# EAGLE schematic 02A-007 Input Switch (EAGLE 6.3)
Assembly variants: HIGHSPEED

## Sheet 1 of 3
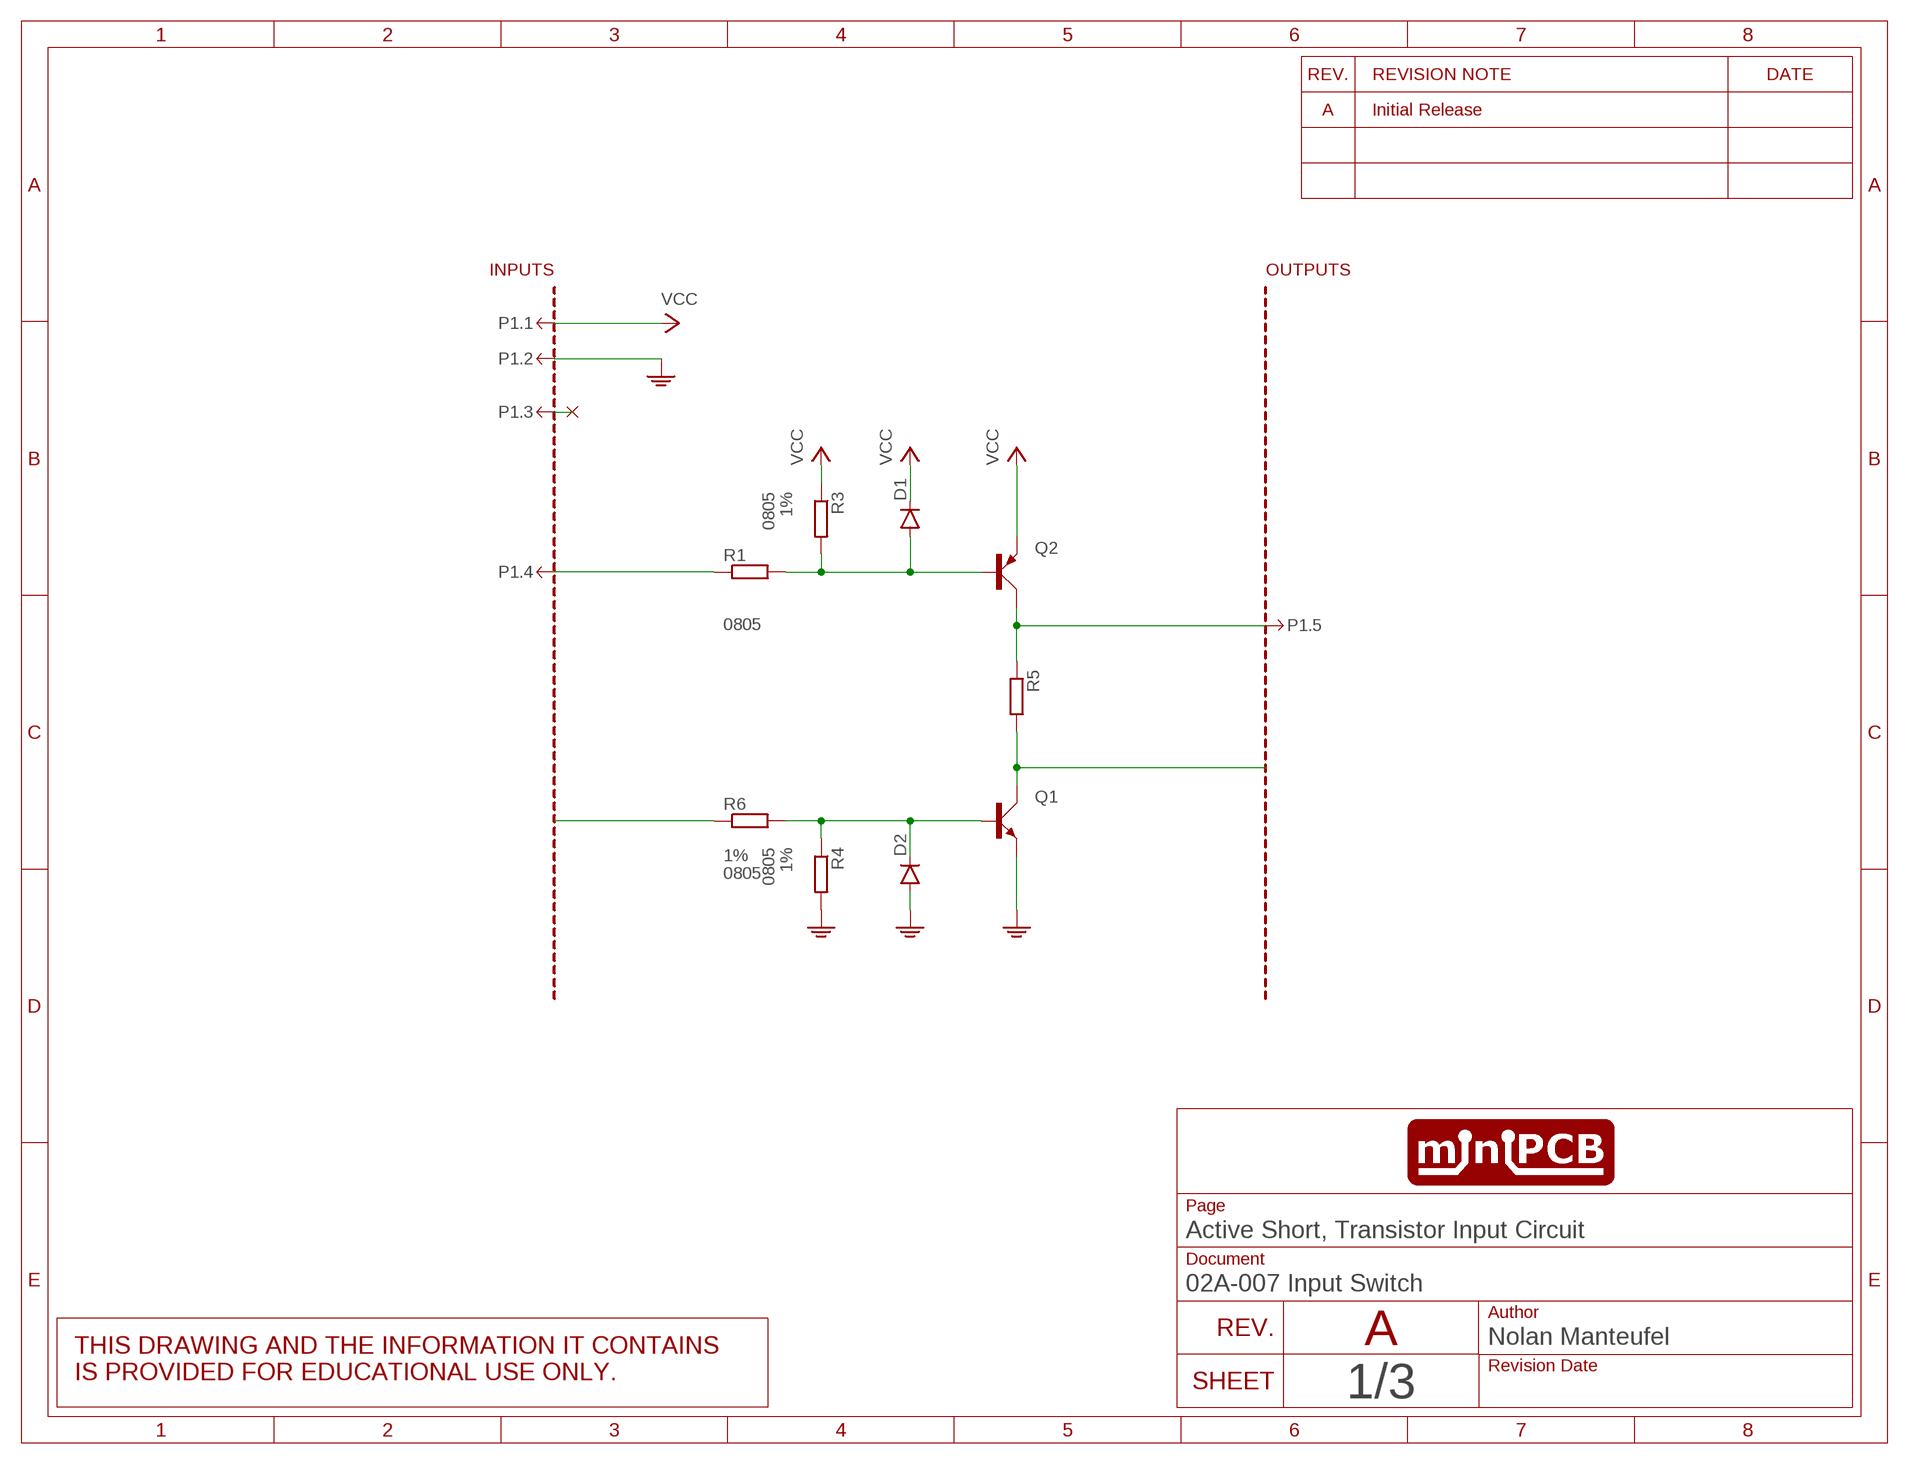
[diagram p0: schematic, sheet 1]

### Parts
D1  DIODE-SOD80C  [SOD80C]  (variant HIGHSPEED: 1N4148)
D2  DIODE-SOD80C  [SOD80C]  (not fitted in variant HIGHSPEED)
P1.  MINIPCB_4INCH  [PCB_5]
Q1  BJT_NPNBEC  [SOT23]
Q2  BJT_PNPBEC  [SOT23]
R1  R-EU_1%_R0805  [R0805]
R3  R-EU_1%_R0805  [R0805]
R4  R-EU_1%_R0805  [R0805]
R5  R-EU__R0805  [R0805]
R6  R-EU_1%_R0805  [R0805]

### Nets
GND: D2.A P1..1 Q1.2(E) R4.2
INPUT: P1..4 R1.1
N$1: D1.A Q2.1(B) R1.2 R3.2
N$2: P1..3
N$3: Q1.3(C) R5.2
N$4: D2.C Q1.1(B) R4.1 R6.2
N$5: P1..5 Q2.3(C) R5.1
N$6: R6.1
VCC: D1.C P1..2 Q2.2(E) R3.1

### Notes on the sheet
- A

## Sheet 2 of 3
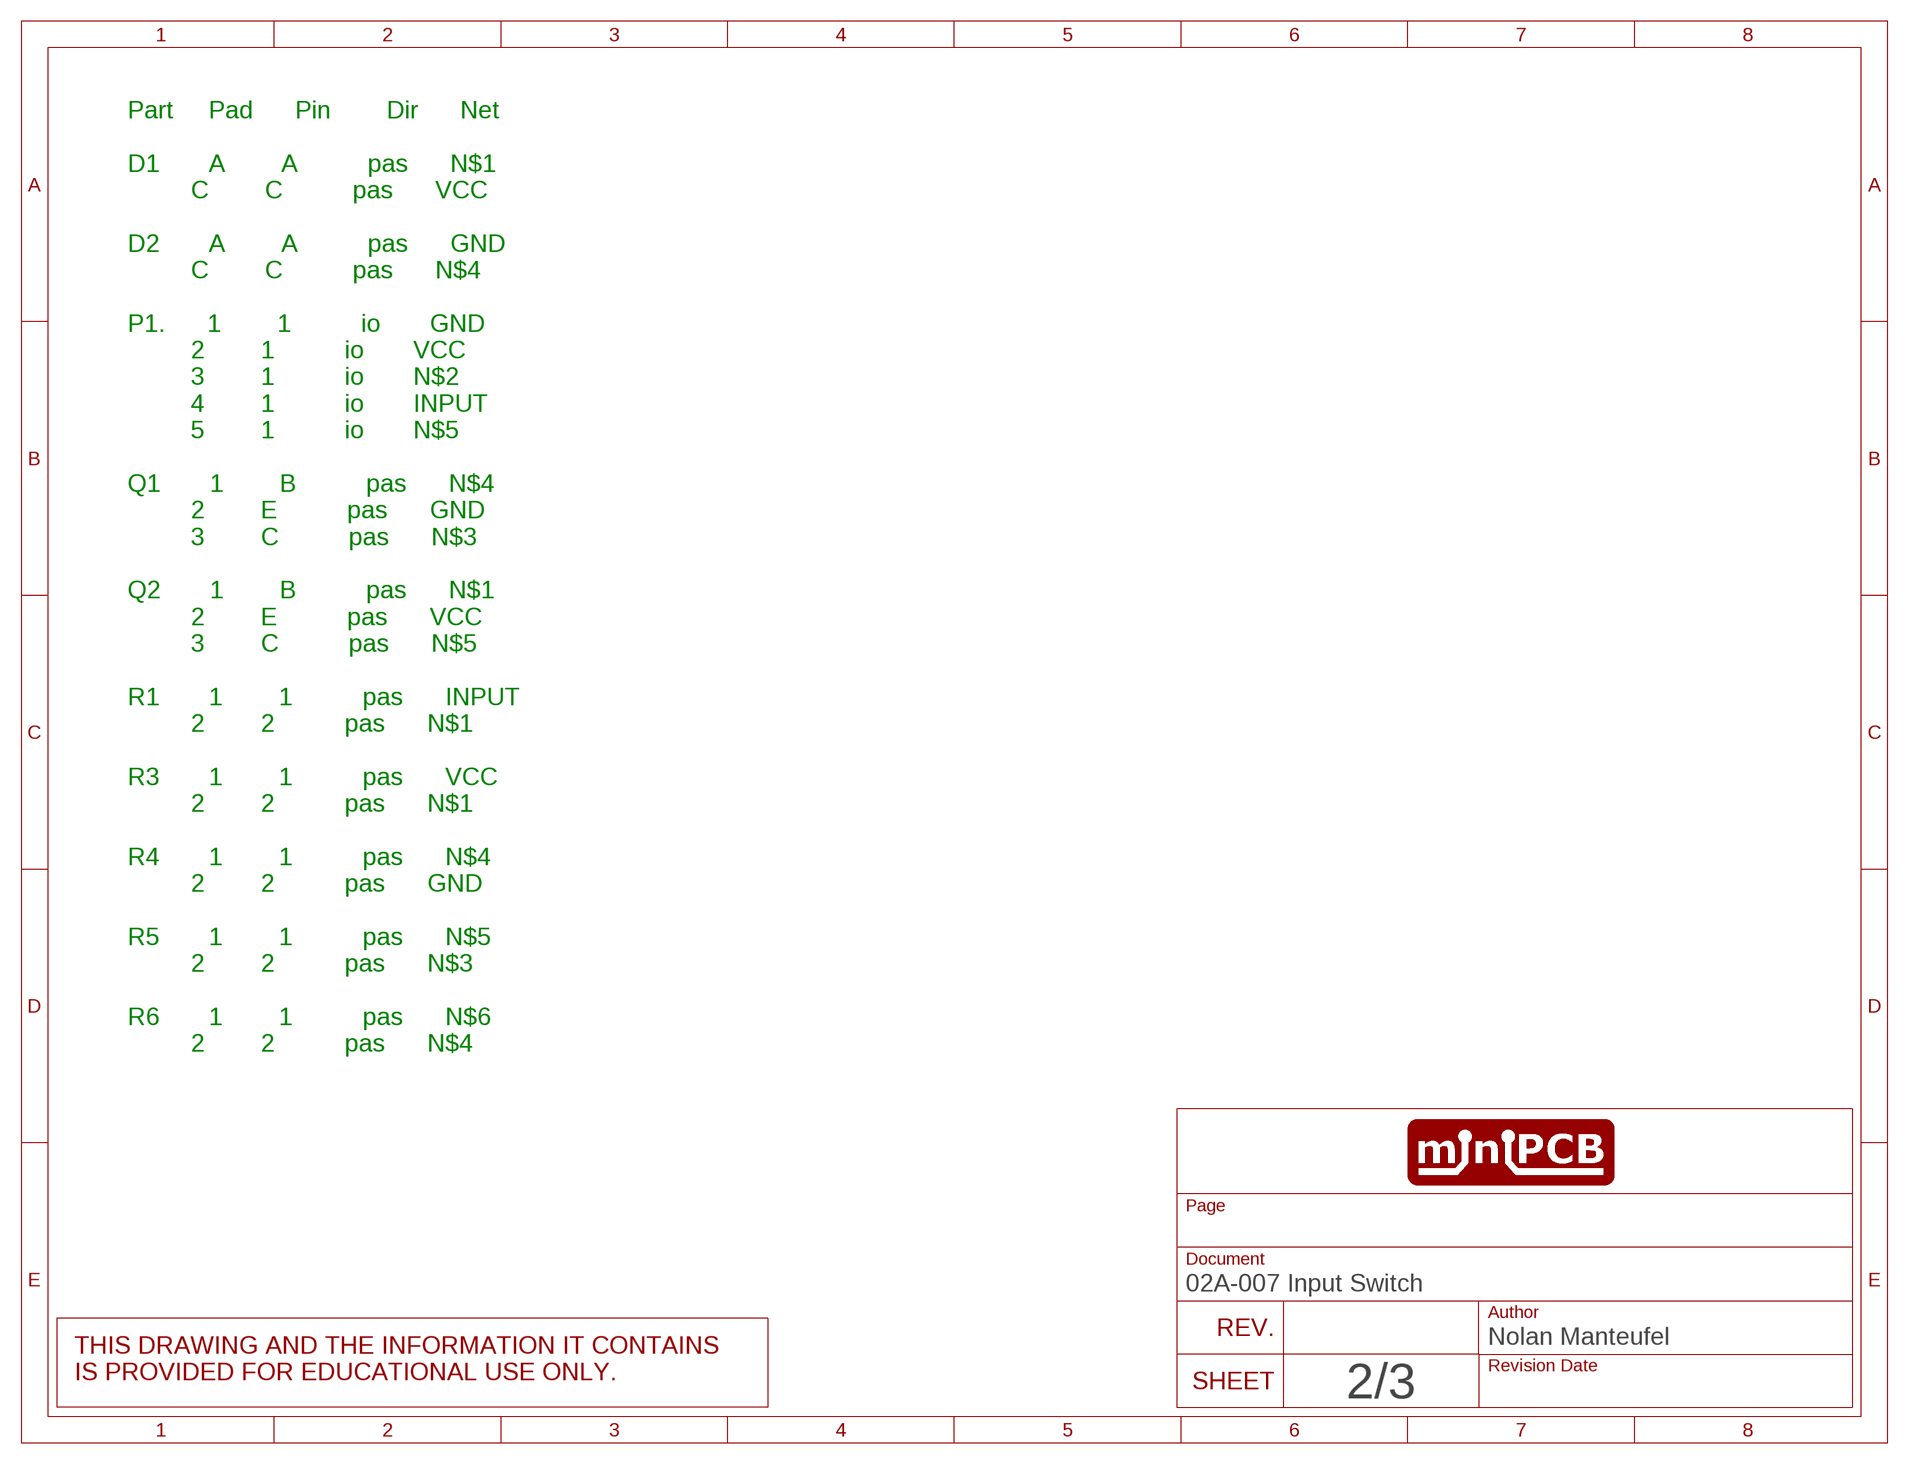
[diagram p1: schematic, sheet 2]

### Notes on the sheet
- Part     Pad      Pin        Dir      Net
  
  D1       A        A          pas      N$1
           C        C          pas      VCC
  
  D2       A        A          pas      GND
           C        C          pas      N$4
  
  P1.      1        1          io       GND
           2        1          io       VCC
           3        1          io       N$2
           4        1          io       INPUT
           5        1          io       N$5
  
  Q1       1        B          pas      N$4
           2        E          pas      GND
           3        C          pas      N$3
  
  Q2       1        B          pas      N$1
           2        E          pas      VCC
           3        C          pas      N$5
  
  R1       1        1          pas      INPUT
           2        2          pas      N$1
  
  R3       1        1          pas      VCC
           2        2          pas      N$1
  
  R4       1        1          pas      N$4
           2        2          pas      GND
  
  R5       1        1          pas      N$5
           2        2          pas      N$3
  
  R6       1        1          pas      N$6
           2        2          pas      N$4

## Sheet 3 of 3
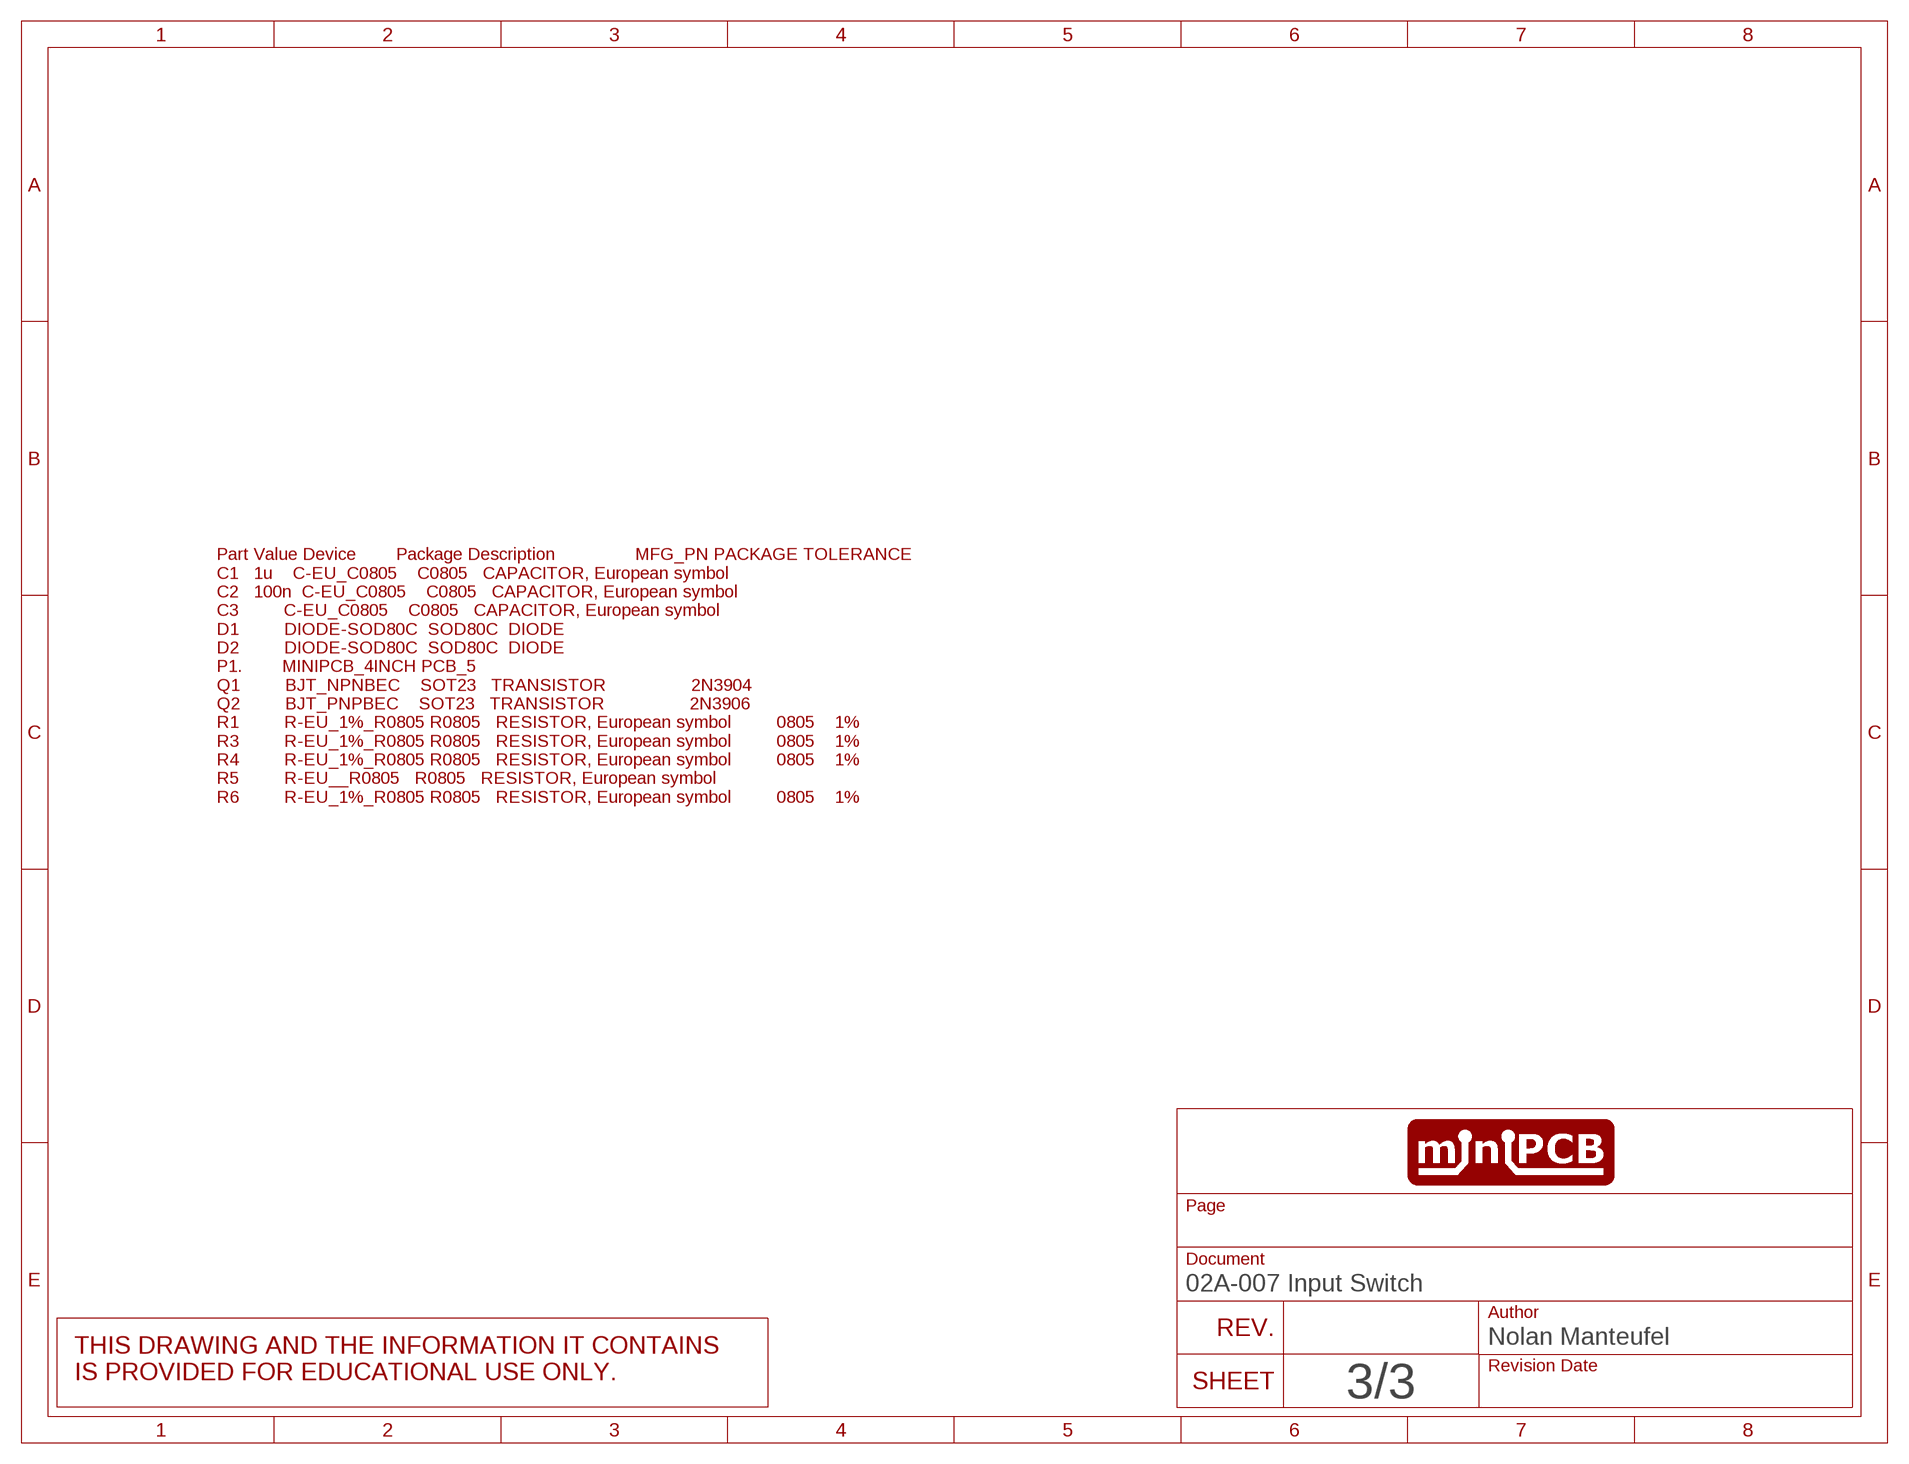
[diagram p2: schematic, sheet 3]

### Notes on the sheet
- Part Value Device        Package Description                MFG_PN PACKAGE TOLERANCE
  C1   1u    C-EU_C0805    C0805   CAPACITOR, European symbol                         
  C2   100n  C-EU_C0805    C0805   CAPACITOR, European symbol                         
  C3         C-EU_C0805    C0805   CAPACITOR, European symbol                         
  D1         DIODE-SOD80C  SOD80C  DIODE                                              
  D2         DIODE-SOD80C  SOD80C  DIODE                                              
  P1.        MINIPCB_4INCH PCB_5                                                      
  Q1         BJT_NPNBEC    SOT23   TRANSISTOR                 2N3904                  
  Q2         BJT_PNPBEC    SOT23   TRANSISTOR                 2N3906                  
  R1         R-EU_1%_R0805 R0805   RESISTOR, European symbol         0805    1%       
  R3         R-EU_1%_R0805 R0805   RESISTOR, European symbol         0805    1%       
  R4         R-EU_1%_R0805 R0805   RESISTOR, European symbol         0805    1%       
  R5         R-EU__R0805   R0805   RESISTOR, European symbol                          
  R6         R-EU_1%_R0805 R0805   RESISTOR, European symbol         0805    1%

## Library data of the parts
D1 D2 = nolan:DIODE-: DIODE
P1. = nolan:MINIPCB_4INCH
Q1 = nolan:BJT_NPN: TRANSISTOR; MFG_PN: 2N3904
Q2 = nolan:BJT_PNP: TRANSISTOR; MFG_PN: 2N3906
R1 R3 R4 R6 = nolan:R-EU_: RESISTOR, European symbol; PACKAGE: 0805; TOLERANCE: 1%
R5 = nolan:R-EU_: RESISTOR, European symbol